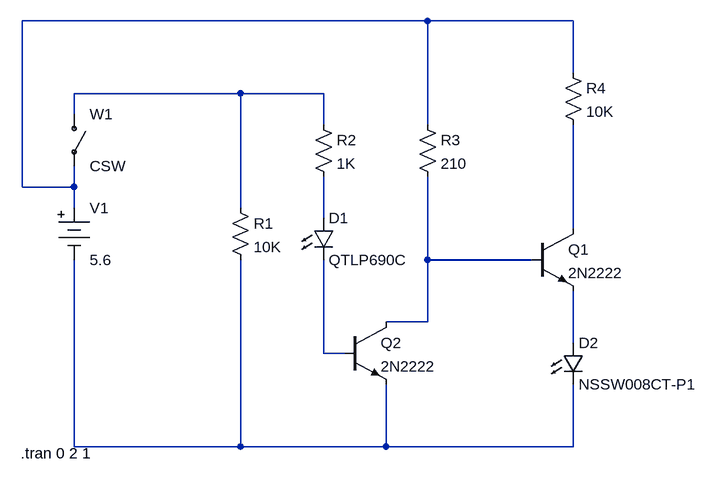
[diagram p0: schematic Deurbel_circuit-20200406-2346_LTspice.asc]
Deurbel_circuit-20200406-2346_LTspice.asc, the LTspice schematic file:
Version 4
SHEET 1 932 680
WIRE 512 -176 -112 -176
WIRE 736 -176 512 -176
WIRE 736 -96 736 -176
WIRE 224 -64 -32 -64
WIRE 352 -64 224 -64
WIRE -32 -32 -32 -64
WIRE 352 -16 352 -64
WIRE 512 -16 512 -176
WIRE -112 80 -112 -176
WIRE -32 80 -32 48
WIRE -32 80 -112 80
WIRE -32 112 -32 80
WIRE 224 112 224 -64
WIRE 352 128 352 64
WIRE 736 144 736 -16
WIRE 512 192 512 64
WIRE 672 192 512 192
WIRE 512 288 512 192
WIRE 512 288 448 288
WIRE 736 320 736 240
WIRE 352 336 352 192
WIRE 384 336 352 336
WIRE -32 480 -32 192
WIRE 224 480 224 192
WIRE 224 480 -32 480
WIRE 448 480 448 384
WIRE 448 480 224 480
WIRE 736 480 736 384
WIRE 736 480 448 480
SYMBOL Misc\\battery -32 96 R0
WINDOW 123 0 0 Left 0
WINDOW 39 0 0 Left 0
SYMATTR InstName V1
SYMATTR Value 5.6
SYMBOL res 208 96 R0
SYMATTR InstName R1
SYMATTR Value 10K
SYMATTR SpiceLine tol=1 pwr=0.1
SYMBOL res 336 -32 R0
SYMATTR InstName R2
SYMATTR Value 1K
SYMATTR SpiceLine tol=1 pwr=0.1
SYMBOL res 496 -32 R0
SYMATTR InstName R3
SYMATTR Value 210
SYMATTR SpiceLine tol=1 pwr=0.1
SYMBOL res 720 -112 R0
SYMATTR InstName R4
SYMATTR Value 10K
SYMATTR SpiceLine tol=1 pwr=0.1
SYMBOL npn 384 288 R0
SYMATTR InstName Q2
SYMATTR Value 2N2222
SYMBOL LED 336 128 R0
SYMATTR InstName D1
SYMATTR Value QTLP690C
SYMBOL LED 720 320 R0
SYMATTR InstName D2
SYMATTR Value NSSW008CT-P1
SYMBOL npn 672 144 R0
SYMATTR InstName Q1
SYMATTR Value 2N2222
SYMBOL csw -32 -32 R0
SYMATTR InstName W1
TEXT -114 490 Left 2 !.tran 0 2 1

The netlist it stands for:
* Deurbel_circuit-20200406-2346_LTspice.asc
V1 N001 N008 5.6
R1 N002 N008 10K tol=1 pwr=0.1
R2 N002 N003 1K tol=1 pwr=0.1
R3 N001 N005 210 tol=1 pwr=0.1
R4 N001 N004 10K tol=1 pwr=0.1
Q2 N005 N007 N008 0 2N2222
D1 N003 N007 QTLP690C
D2 N006 N008 NSSW008CT-P1
Q1 N004 N005 N006 0 2N2222
W1 N002 N001 CSW
.model D D
.lib standard.dio
.model NPN NPN
.model PNP PNP
.lib standard.bjt
.tran 0 2 1
.backanno
.end